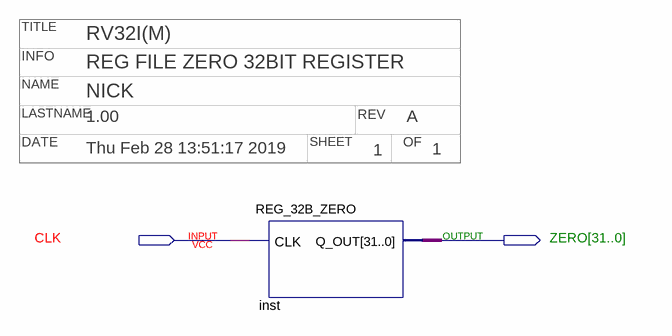
[diagram p0: schematic sheet]
// Quartus schematic REG_32B_ZEROTEST.bdf as structural Verilog: 1 symbols, 2 pins
// Title block: TITLE: RV32I(M); INFO: REG FILE ZERO 32BIT REGISTER; NAME: NICK; LASTNAME: 1.00; REV: A; DATE: Thu Feb 28 13:51:17 2019; SHEET: 1; OF: 1
module REG_32B_ZEROTEST (
  input  CLK,
  output [31:0] ZERO
);

  REG_32B_ZERO inst (.CLK(CLK), .Q_OUT(ZERO));
endmodule
